# Altium schematic sheet AYBR3000和泰LCD控制器.SchDoc
size A2
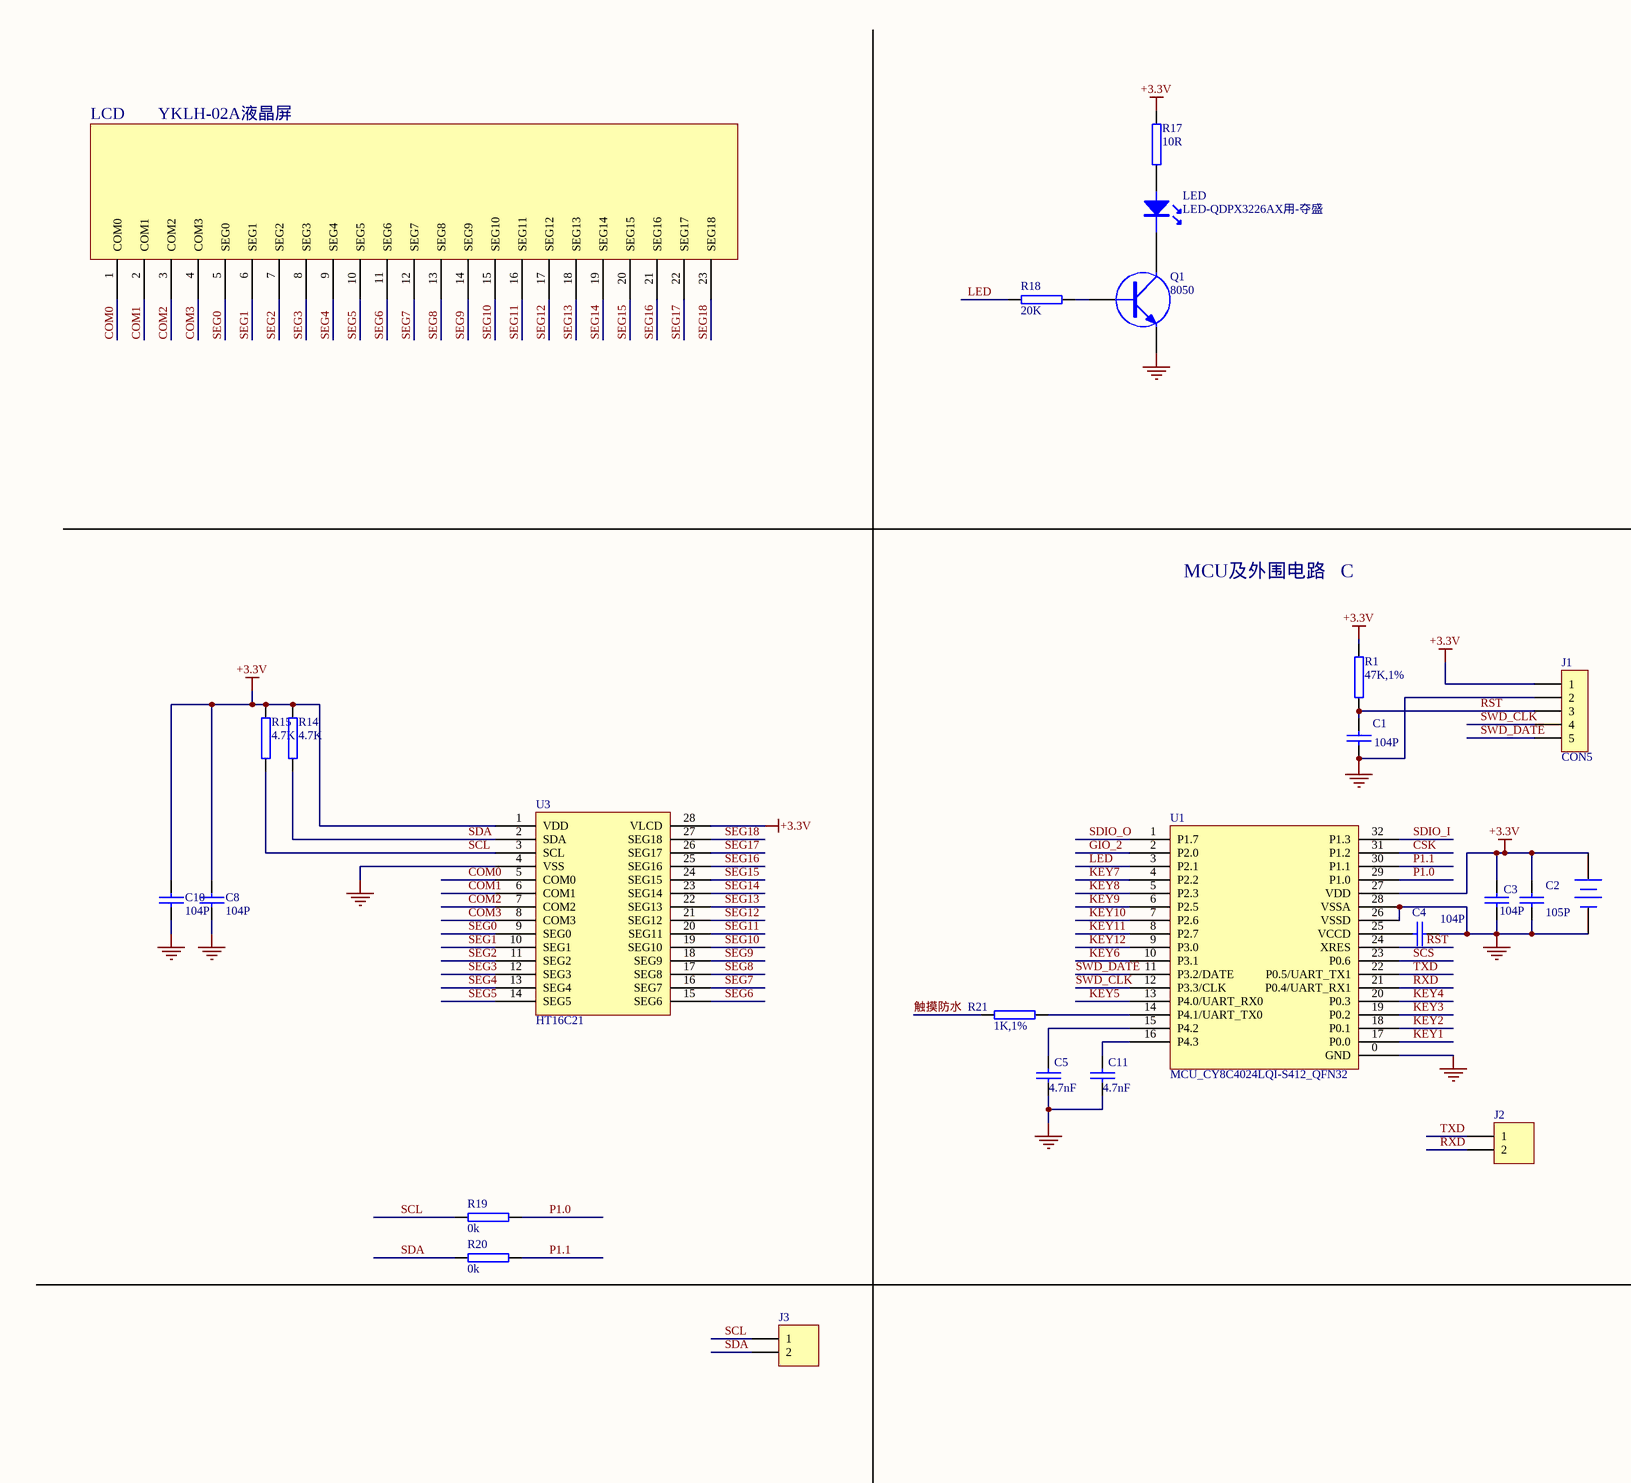
[diagram p0: AYBR3000和泰LCD控制器.SchDoc, left]
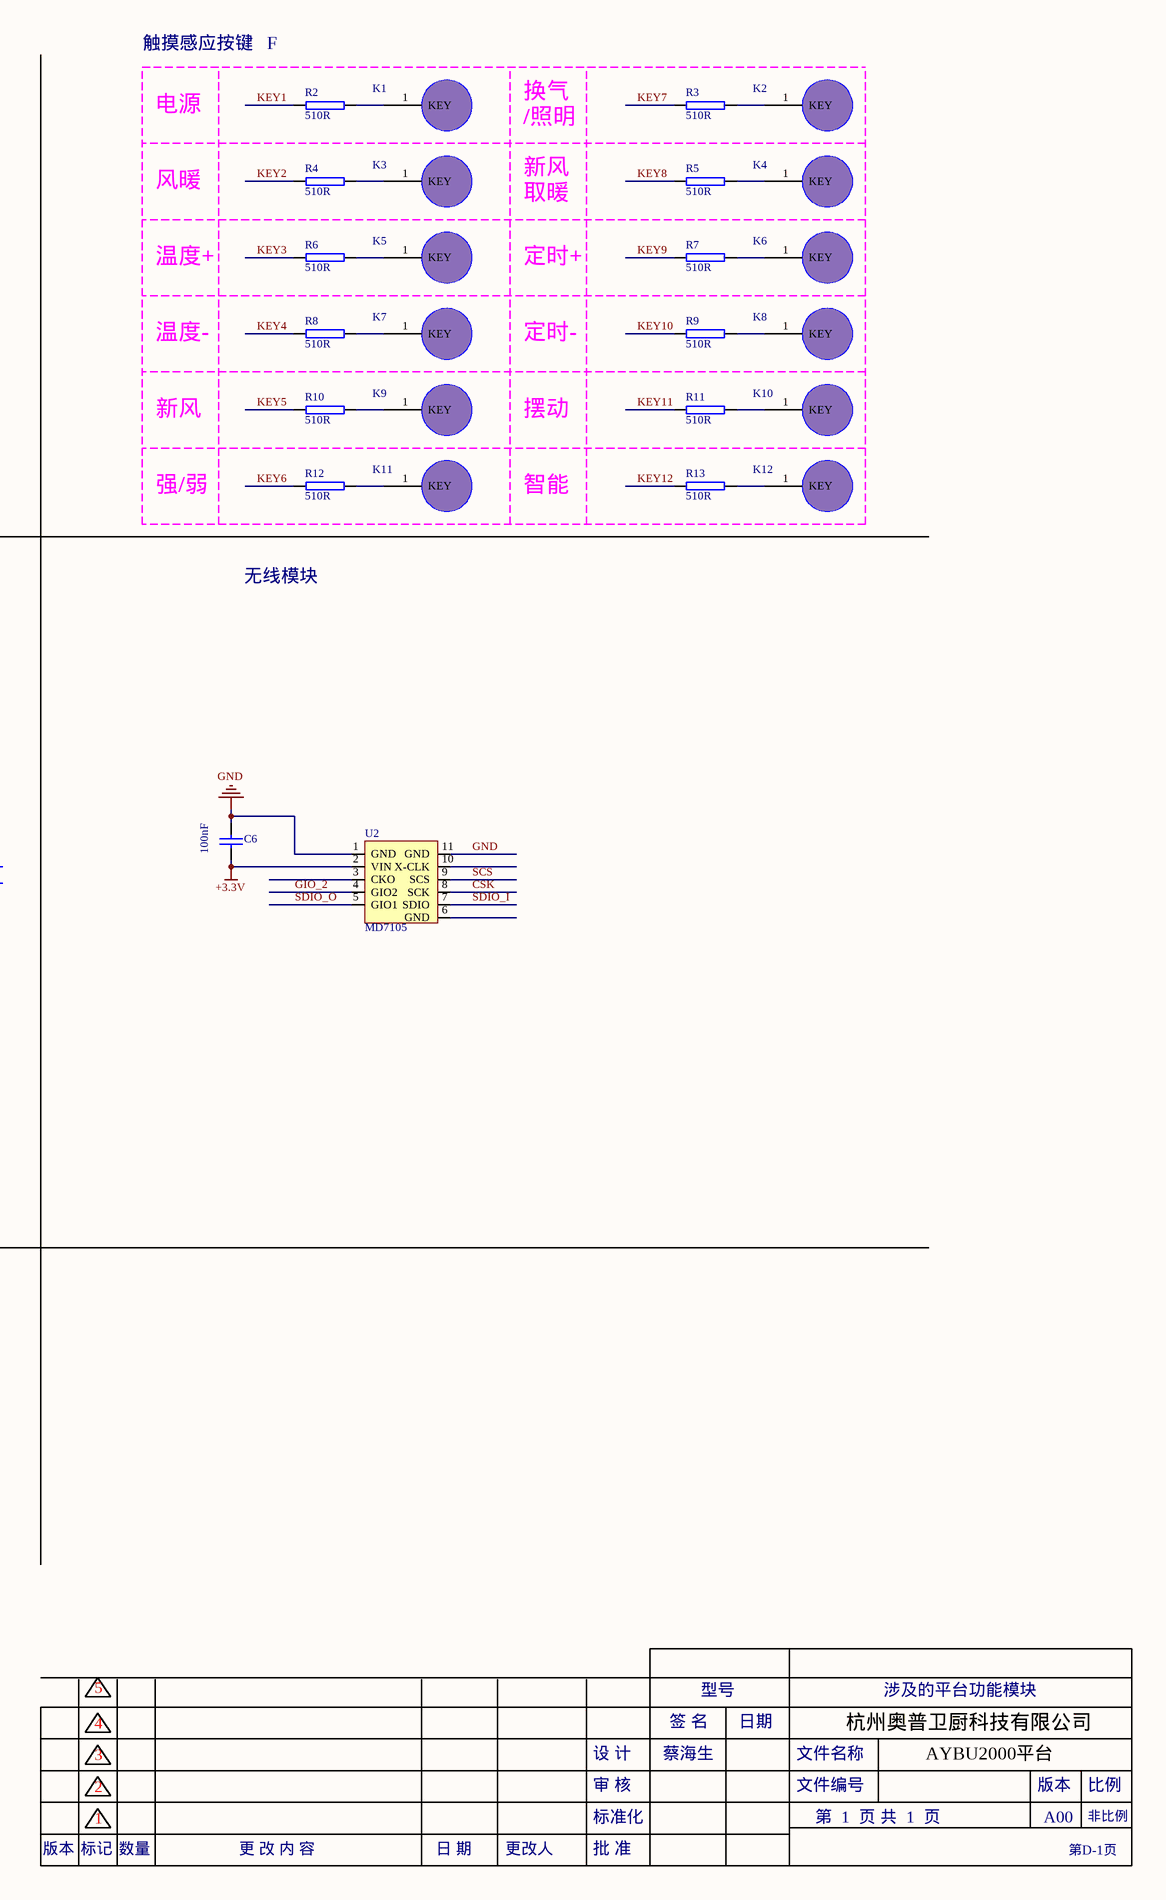
[diagram p1: AYBR3000和泰LCD控制器.SchDoc, right]

## Parts
?  (no value)  [BAT-2]
C1  104P  [C0603-T]
C2  105P  [C0603-T]
C3  104P  [C0603-T]
C4  104P  [C0603-T]
C5  4.7nF  [C0603-T]
C6  100nF  [C0603-G]
C8  104P  [C0603-T]
C10  104P  [C0603-T]
C11  4.7nF  [C0603-T]
J1  CON5  [PZ-1*5-M-DO]
J2  (no value)  [SIP-2_54-2P]
J3  (no value)  [SIP-2_54-2P]
K1  (no value)  [GYTH-YKLH-02A]
K2  (no value)  [GYTH-YKLH-02A]
K3  (no value)  [GYTH-YKLH-02A]
K4  (no value)  [GYTH-YKLH-02A]
K5  (no value)  [GYTH-YKLH-02A]
K6  (no value)  [GYTH-YKLH-02A]
K7  (no value)  [GYTH-YKLH-02A]
K8  (no value)  [GYTH-YKLH-02A]
K9  (no value)  [GYTH-YKLH-02A]
K10  (no value)  [GYTH-YKLH-02A]
K11  (no value)  [GYTH-YKLH-02A]
K12  (no value)  [GYTH-YKLH-02A]
LCD  YKLH-02A液晶屏  [LCD-YKLH-02A]
LED  LED-QDPX3226AX用-夺盛  [BLK-YKLH-02A-2]
Q1  8050  [SOT23-BEC-G]
R1  47K,1%  [R0603-T]
R2  510R  [R0603-T]
R3  510R  [R0603-T]
R4  510R  [R0603-T]
R5  510R  [R0603-T]
R6  510R  [R0603-T]
R7  510R  [R0603-T]
R8  510R  [R0603-T]
R9  510R  [R0603-T]
R10  510R  [R0603-T]
R11  510R  [R0603-T]
R12  510R  [R0603-T]
R13  510R  [R0603-T]
R14  4.7K  [R0603-T]
R15  4.7K  [R0603-T]
R17  10R  [R1206-T]
R18  20K  [C0603-T]
R19  0k  [R0603-T]
R20  0k  [R0603-T]
R21  1K,1%  [R0603-T]
U1  MCU_CY8C4024LQI-S412_QFN32  [QFN32-5*5]
U2  MD7105  [MD7105-A04]
U3  HT16C21  [SOP28-HT16C21]

## Nets
+3.3V: ?.1(+) C2.2 C3.2 C6.2 C8.2 C10.2 J1.1 R1.2 R14.1 R15.1 R17.2 U1.27(VDD) U2.2(VIN) U3.1(VDD) U3.28(VLCD)
GND: ?.2(-) C1.2 C2.1 C3.1 C4.1 C5.1 C6.1 C8.1 C10.1 C11.1 J1.2 Q1.E U1.0(GND) U1.26(VSSD) U1.28(VSSA) U2.1(GND) U2.11(GND) U3.4(VSS)
COM0: LCD.1(COM0) U3.5(COM0)
COM1: LCD.2(COM1) U3.6(COM1)
COM2: LCD.3(COM2) U3.7(COM2)
COM3: LCD.4(COM3) U3.8(COM3)
CSK: U1.31(P1.2) U2.8(SCK)
GIO_2: U1.2(P2.0) U2.4(GIO2)
KEY1: R2.2 U1.17(P0.0)
KEY2: R4.2 U1.18(P0.1)
KEY3: R6.2 U1.19(P0.2)
KEY4: R8.2 U1.20(P0.3)
KEY5: R10.2 U1.13(P4.0/UART_RX0)
KEY6: R12.2 U1.10(P3.1)
KEY7: R3.2 U1.4(P2.2)
KEY8: R5.2 U1.5(P2.3)
KEY9: R7.2 U1.6(P2.5)
KEY10: R9.2 U1.7(P2.6)
KEY11: R11.2 U1.8(P2.7)
KEY12: R13.2 U1.9(P3.0)
LED: R18.2 U1.3(P2.1)
P1.0: R19.1 U1.29(P1.0)
P1.1: R20.1 U1.30(P1.1)
RST: C1.1 J1.3 R1.1 U1.24(XRES)
RXD: J2.2 U1.21(P0.4/UART_RX1)
SCL: J3.1 R15.2 R19.2 U3.3(SCL)
SCS: U1.23(P0.6) U2.9(SCS)
SDA: J3.2 R14.2 R20.2 U3.2(SDA)
SDIO_I: U1.32(P1.3) U2.7(SDIO)
SDIO_O: U1.1(P1.7) U2.5(GIO1)
SEG0: LCD.5(SEG0) U3.9(SEG0)
SEG1: LCD.6(SEG1) U3.10(SEG1)
SEG2: LCD.7(SEG2) U3.11(SEG2)
SEG3: LCD.8(SEG3) U3.12(SEG3)
SEG4: LCD.9(SEG4) U3.13(SEG4)
SEG5: LCD.10(SEG5) U3.14(SEG5)
SEG6: LCD.11(SEG6) U3.15(SEG6)
SEG7: LCD.12(SEG7) U3.16(SEG7)
SEG8: LCD.13(SEG8) U3.17(SEG8)
SEG9: LCD.14(SEG9) U3.18(SEG9)
SEG10: LCD.15(SEG10) U3.19(SEG10)
SEG11: LCD.16(SEG11) U3.20(SEG11)
SEG12: LCD.17(SEG12) U3.21(SEG12)
SEG13: LCD.18(SEG13) U3.22(SEG13)
SEG14: LCD.19(SEG14) U3.23(SEG14)
SEG15: LCD.20(SEG15) U3.24(SEG15)
SEG16: LCD.21(SEG16) U3.25(SEG16)
SEG17: LCD.22(SEG17) U3.26(SEG17)
SEG18: LCD.23(SEG18) U3.27(SEG18)
SWD_CLK: J1.4 U1.12(P3.3/CLK)
SWD_DATE: J1.5 U1.11(P3.2/DATE)
TXD: J2.1 U1.22(P0.5/UART_TX1)
触摸防水: R21.2
NetC4_2: C4.2 U1.25(VCCD)
NetC5_2: C5.2 U1.15(P4.2)
NetC11_2: C11.2 U1.16(P4.3)
NetK1_1: K1.1(KEY) R2.1
NetK2_1: K2.1(KEY) R3.1
NetK3_1: K3.1(KEY) R4.1
NetK4_1: K4.1(KEY) R5.1
NetK5_1: K5.1(KEY) R6.1
NetK6_1: K6.1(KEY) R7.1
NetK7_1: K7.1(KEY) R8.1
NetK8_1: K8.1(KEY) R9.1
NetK9_1: K9.1(KEY) R10.1
NetK10_1: K10.1(KEY) R11.1
NetK11_1: K11.1(KEY) R12.1
NetK12_1: K12.1(KEY) R13.1
NetLED_A: LED.A R17.1
NetLED_K: LED.K Q1.C
NetQ1_B: Q1.B R18.1
NetR21_1: R21.1 U1.14(P4.1/UART_TX0)

Not connected (* = marked no-connect by the designer): U2 3(CKO) 6(GND) 10(X-CLK)

## Notes on the sheet
- 触摸感应按键   F
- 换气
- 电源
- /照明
- 风暖
- 新风
- 取暖
- 温度+
- 定时+
- 温度-
- 定时-
- 摆动
- 强/弱
- 智能
- MCU及外围电路   C
- 无线模块
- 4
- 5
- 签 名
- 型号
- 日期
- 杭州奥普卫厨科技有限公司
- 涉及的平台功能模块
- 2
- 3
- 设 计
- 审 核
- 蔡海生
- 文件名称
- 文件编号
- AYBU2000平台
- 版本
- 比例
- 标记
- 1
- 数量
- 更 改 内 容
- 日 期
- 更改人
- 批 准
- 标准化
- 第  1  页 共  1  页
- A00
- 第D-1页
- 非比例

## Library data of the parts
? = Battery: Multicell Battery; Published: 24-Mar-1999; LatestRevisionDate: 17-Jul-2002; LatestRevisionNote: Re-released for DXP Platform.; PackageReference: BAT-2; Publisher: Altium Limited; PackageDescription: Battery; 2 Leads
C1-C5 C8 C10 C11 = CAP: Capacitor
C6 = CAP
J1 = CON5: Connector
J2 J3 = CMA-6542PF: Header, 2-Pin
K1-K12 = KEY_TCH
LED = LED
Q1 = NPN: NPN Transistor
R1-R15 R17-R21 = RES2